# Altium schematic sheet pca20053_sheet1_connections.SchDoc: Thingy:53 Connections
size A3; Organization: Nordic Semiconductor; DocumentNumber: 1; SheetNumber: 1; SheetTotal: 6; CompanyName: Nordic Semiconductor; DocumentSize: A3
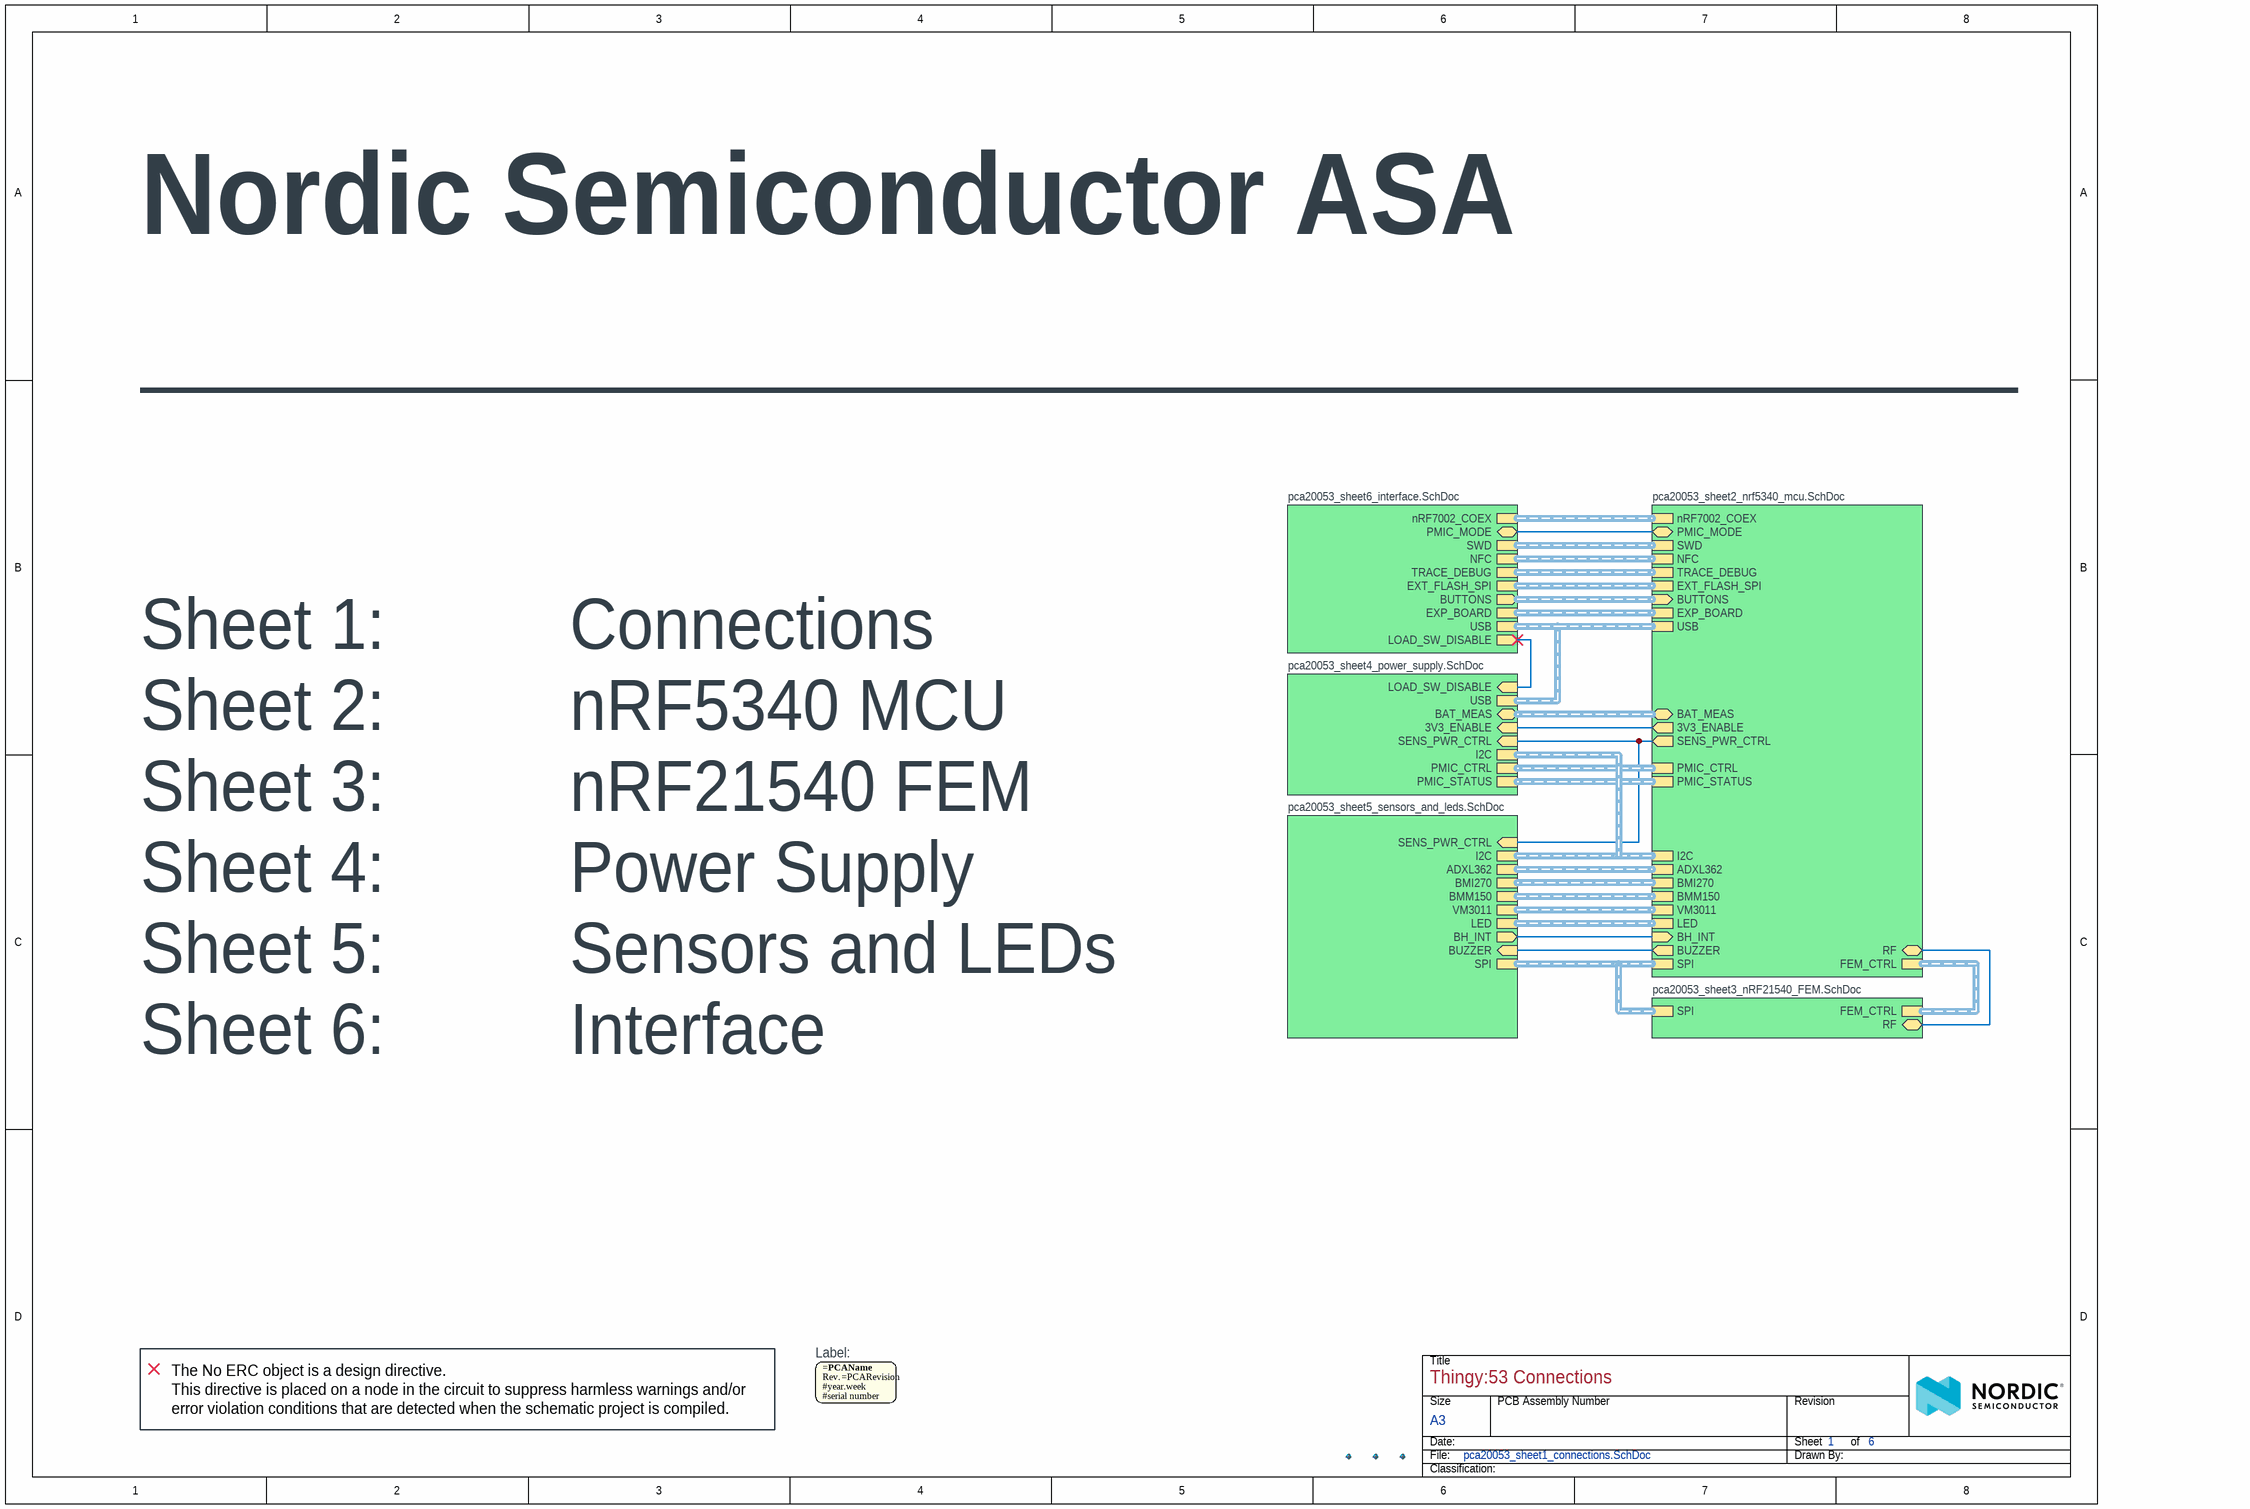
[diagram p0: pca20053_sheet1_connections.SchDoc]

## Parts
Fid1  Fiducial mark  [Fiducial_Round-Square]  (value not drawn)
Fid2  Fiducial mark  [Fiducial_Round-Square]  (value not drawn)
Fid3  Fiducial mark  [Fiducial_Round-Square]  (value not drawn)
LABEL  8x32mm  [LabelSilk_8x32]  (value not drawn)

## Sub-sheets
? = pca20053_sheet2_nrf5340_mcu.SchDoc: USB (harness USB), SWD (harness SWD), FEM_CTRL (harness FEM_CTRL), BUZZER (out), BH_INT (in), LED (harness LED), I2C (harness I2C), BUTTONS (in, harness BUTTONS), SPI (harness SPI), BMI270 (harness BMI270), ADXL362 (harness ADXL), RF (bidir), PMIC_STATUS (harness PMIC_STATUS), NFC (harness NFC), VM3011 (harness VM3011), BMM150 (harness BMM150), TRACE_DEBUG (harness TRACE), EXT_FLASH_SPI (harness QSPI), EXP_BOARD (harness EXP_BOARD), PMIC_CTRL (harness PMIC_CTRL), BAT_MEAS (bidir, harness BAT_MEAS), 3V3_ENABLE (out), SENS_PWR_CTRL (out), PMIC_MODE (bidir), nRF7002_COEX (harness PMIC_STATUS)
? = pca20053_sheet5_sensors_and_leds.SchDoc: BUZZER (in), I2C (harness I2C), BH_INT (out), LED (harness LED), SPI (harness SPI), ADXL362 (harness ADXL), BMI270 (harness BMI270), VM3011 (harness VM3011), BMM150 (harness BMM150), SENS_PWR_CTRL (in)
? = pca20053_sheet3_nRF21540_FEM.SchDoc: FEM_CTRL (harness FEM_CTRL), RF (bidir), SPI (harness SPI)
? = pca20053_sheet6_interface.SchDoc: USB (harness USB), SWD (harness SWD), BUTTONS (out, harness BUTTONS), LOAD_SW_DISABLE (out), NFC (harness NFC), TRACE_DEBUG (harness TRACE), EXT_FLASH_SPI (harness QSPI), EXP_BOARD (harness EXP_BOARD), PMIC_MODE (bidir), nRF7002_COEX (harness PMIC_STATUS)
? = pca20053_sheet4_power_supply.SchDoc: USB (harness USB), PMIC_STATUS (harness PMIC_STATUS), LOAD_SW_DISABLE (in), PMIC_CTRL (harness PMIC_CTRL), BAT_MEAS (bidir, harness BAT_MEAS), 3V3_ENABLE (in), SENS_PWR_CTRL (in), I2C (harness I2C)

## Nets
(unnamed): sheet /BUZZER, sheet /BUZZER
(unnamed): sheet /BH_INT, sheet /BH_INT
(unnamed): sheet /RF, sheet /RF
(unnamed): sheet /3V3_ENABLE, sheet /3V3_ENABLE
(unnamed): sheet /SENS_PWR_CTRL, sheet /SENS_PWR_CTRL, sheet /SENS_PWR_CTRL
(unnamed): sheet /PMIC_MODE, sheet /PMIC_MODE
(unnamed): sheet /LOAD_SW_DISABLE, sheet /LOAD_SW_DISABLE

## Notes on the sheet
- Nordic Semiconductor ASA
- ___________________________________________
- Sheet 1:          Connections
- Sheet 2:          nRF5340 MCU
- Sheet 3:          nRF21540 FEM
- Sheet 4:          Power Supply
- Sheet 5:          Sensors and LEDs
- Sheet 6:          Interface
- (near LABEL) Label:
- (near LABEL) The No ERC object is a design directive.
  This directive is placed on a node in the circuit to suppress harmless warnings and/or error violation conditions that are detected when the schematic project is compiled.
- Title
- Size
- Date:
- File:
- A3
- PCB Assembly Number
- Sheet         of
- Drawn By:
- Revision
- Classification:
- (in symbol Label_8x32) Rev.; #year.week; #serial number

## Library data of the parts
Fid1-Fid3 = Fid-Mark-Round-Square: Manufacturer: N.A.; Part number NEMS: 100500075; Value: N.A.; Pad Count: 1; Component Status: Active; System: Connector; Part Number: Fid-Mark-Round-Square; Manufacturer Part Number: N.A.; LatestRevisionDate: 2017-01-30; Published: 2009-12-12; Note: N.A.; Artikkelnr Noca: N.A.; Footprint Doc: Fiducial; Part number IPS: N.A.; ComponentLink1URL: N.A.; ComponentLink1Description: Datasheet; ComponentLink2URL: N.A.; ComponentLink2Description: Supplier link; HelpURL: N.A.; Supplier 1: N.A.; Supplier Part Number 1: N.A.; Supplier 2: N.A.; Supplier Part Number 2: N.A.; Component Class: Connectors; PartId: 100500075; Author: rsk; Part number Norautron: N.A.
LABEL = Label_8x32: PCA version label, stick-on, 8x32mm; Manufacturer: Ellco Etikett; Manufacturer Part Number: 57382; Part number NEMS: 101200026; Component Status: Active; Pad Count: 0; Note: N.A.; Part Number: Label_8x32; PartId: 101200026; Component Class: Mechanicals; Author: hany; ComponentLink1URL: N.A.; ComponentLink1Description: Datasheet; ComponentLink2URL: N.A.; ComponentLink2Description: Supplier link; HelpURL: N.A.; LatestRevisionDate: 2023-01-05; Published: 2023-01-05; Footprint Doc: Label; Value: 8x32mm; Supplier 1: N.A.; Supplier Part Number 1: N.A.; Supplier 2: N.A.; Supplier Part Number 2: N.A.; Artikkelnr Noca: N.A.; Part number IPS: N.A.; Part number Norautron: N.A.